# EAGLE design Olimex ESP32 POE Wing (EAGLE 9.6.0)
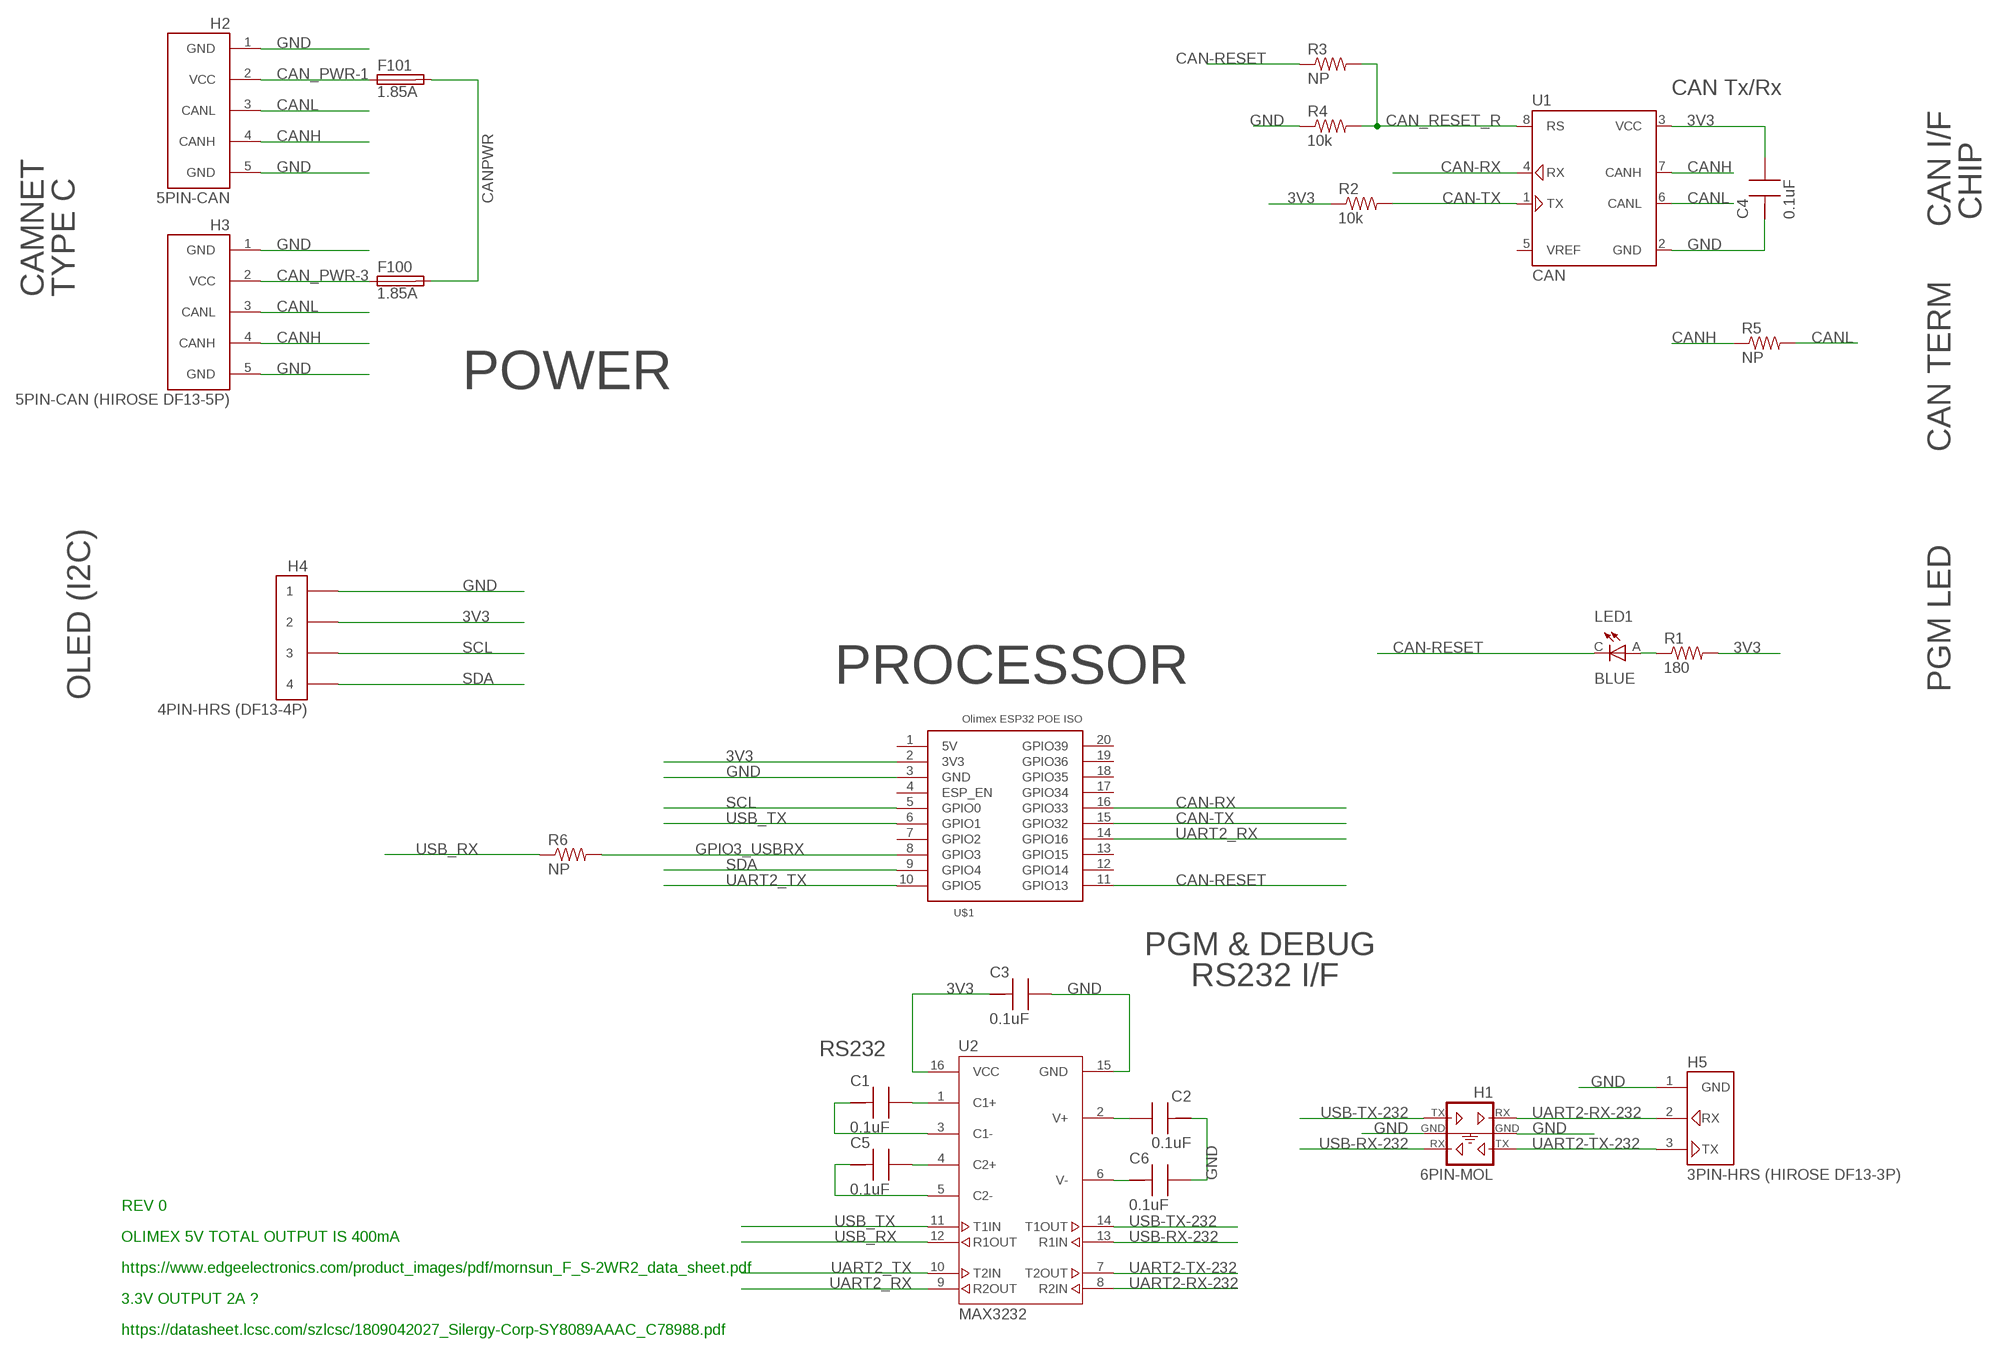
[diagram p0: schematic, sheet 1]

## Parts
C1  0.1uF  C-USC0805  [C0805]
C2  0.1uF  C-USC0805  [C0805]
C3  0.1uF  C-USC0805  [C0805]
C4  0.1uF  C-USC0805  [C0805]
C5  0.1uF  C-USC0805  [C0805]
C6  0.1uF  C-USC0805  [C0805]
F100  1.85A  BEL-OZCD  [2920]
F101  1.85A  BEL-OZCD  [2920]
H1  6PIN-MOL  6PIN-PGM-2MMVTH  [87831-0620]
H2  5PIN-CAN  5PIN-CAN-1.25MMVTH  [DF13-5P-1.25DSA]
H3  5PIN-CAN (HIROSE DF13-5P)  5PIN-CAN-1.25MMVTH  [DF13-5P-1.25DSA]
H4  4PIN-HRS (DF13-4P)  DF13-4P-1.25VTH  [DF13-4P-1.25DSA]
H5  3PIN-HRS (HIROSE DF13-3P)  3PIN-PGM-1.25MMVTH  [DF13-3P-1.25DSA]
LED1  BLUE  LED805SMT  [CHIPLED_0805]
R1  180  R-US_R0805  [R0805]
R2  10k  R-US_R0805  [R0805]
R3  NP  R-US_R0805  [R0805]
R4  10k  R-US_R0805  [R0805]
R5  NP  R-US_R0805  [R0805]
R6  NP  R-US_R0805  [R0805]
U1  CAN  SN65HVD230DR  [SO-08]
U2  MAX3232  MAX3232TSSOP16  [TSSOP16]
U$1  OLIMEX_POE_ISOPOEISO  [OLIMEX_POE_ISO]

## Nets
3V3 [Power]: C3.2(-) C4.1(+) H4.2 R1.2 R2.1 U1.3(VCC) U2.16(VCC) U$1.2(3V3)
BLUEX: LED1.A R1.1
C1+: C1.1(+) U2.1(C1+)
C1-: C1.2(-) U2.3(C1-)
C2+: C5.1(+) U2.4(C2+)
C2-: C5.2(-) U2.5(C2-)
CAN-RESET: LED1.C R3.1 U$1.11(GPIO13)
CAN-RX: U1.4(RX) U$1.16(GPIO33)
CAN-TX: R2.2 U1.1(TX) U$1.15(GPIO32)
CAN_PWR-1 [bigpower]: F101.P1 H2.2(VCC)
CAN_PWR-3 [bigpower]: F100.P1 H3.2(VCC)
CAN_RESET_R [DSP]: R3.2 R4.2 U1.8(RS)
CANH: H2.4(CANH) H3.4(CANH) R5.1 U1.7(CANH)
CANL: H2.3(CANL) H3.3(CANL) R5.2 U1.6(CANL)
CANPWR: F100.P2 F101.P2
GND [Power]: C2.2(-) C3.1(+) C4.2(-) C6.1(+) H1.3 H1.4 H2.1(GND) H2.5(GND) H3.1(GND) H3.5(GND) H4.1 H5.1(GND) R4.1 U1.2(GND) U2.15(GND) U$1.3(GND)
GPIO3_USBRX: R6.2 U$1.8(GPIO3)
SCL: H4.3 U$1.5(GPIO0)
SDA: H4.4 U$1.9(GPIO4)
UART2-RX-232: H1.1 H5.2(RX) U2.8(R2IN)
UART2-TX-232: H1.5 H5.3(TX) U2.7(T2OUT)
UART2_RX: U2.9(R2OUT) U$1.14(GPIO16)
UART2_TX: U2.10(T2IN) U$1.10(GPIO5)
USB-RX-232: H1.6 U2.13(R1IN)
USB-TX-232: H1.2 U2.14(T1OUT)
USB_RX: R6.1 U2.12(R1OUT)
USB_TX: U2.11(T1IN) U$1.6(GPIO1)
V+: C2.1(+) U2.2(V+)
V-: C6.2(-) U2.6(V-)
Unconnected: U1.5(VREF) U$1.4(ESP_EN) U$1.7(GPIO2) U$1.12(GPIO14) U$1.13(GPIO15) U$1.17(GPIO34) U$1.18(GPIO35) U$1.19(GPIO36) U$1.20(GPIO39)

## Notes on the sheet
- CAN Tx/Rx
- CAN I/F
- CHIP
- CAMNET | TYPE C
- POWER
- CAN TERM
- PGM LED
- PROCESSOR
- OLED (I2C)
- PGM & DEBUG
- RS232 I/F
- RS232
- REV 0
- OLIMEX 5V TOTAL OUTPUT IS 400mA
- https://www.edgeelectronics.com/product_images/pdf/mornsun_F_S-2WR2_data_sheet.pdf
- 3.3V OUTPUT 2A ?
- https://datasheet.lcsc.com/szlcsc/1809042027_Silergy-Corp-SY8089AAAC_C78988.pdf

## Power pins joined to a net without a drawn wire
5V: U$1.1(5V)

## Library data of the parts
C1-C6 = rcl:C-US: CAPACITOR, American symbol
F100 F101 = fuse:BEL-OZCD: 507-1370-1-ND
H1 = con-standard:6PIN-PGM-: 6 Pin Programming Header Molex Mfg PN: 87831-0620 Digikey PN: WM18558-ND
H2 H3 = con-standard:5PIN-CAN-: 5 Pin CAMNET Header 1.25mm Vertical Through Hole Mfg PN: DF13-5P-1.25DSA Digikey PN: H2194-ND 1.25mm Right Angle Through Hole Mfg PN: DF13-5P-1.25DS Digikey PN: H2202-ND 2mm Vertical Through Hole Mfg PN: DF3-5P-2DSA Digikey PN: H3924-ND
H4 = con-hirose:DF13-4P-1.25
H5 = con-standard:3PIN-PGM-: 3 Pin Programming Header Hirose Mfg PN: DF13-3P-1.25DSA Digikey PN: H2192-ND Right Angle Mfg PN: Digikey PN: Molex Mfg PN: 70553-0037 Digikey PN: WM4925-ND
LED1 = led:LED: LED OSRAM: - CHIPLED LG R971, LG N971, LY N971, LG Q971, LY Q971, LO R971, LY R971 LH N974, LH R974 LS Q976, LO Q976, LY Q976 LO Q996 - Hyper CHIPLED LW Q18S LB Q993, LB Q99A, LB R99A - SideLED LS A670, LO A670, LY A670, LG A670, LP A670 LB A673, LV A673, LT A673, LW A673 LH A674 LY A675 LS A676, LA A676, LO A676, LY A676, LW A676 LS A679, LY A679, LG A679 - Hyper Micro SIDELED® LS Y876, LA Y876, LO Y876, LY Y876 LT Y87S - SmartLED LW L88C, LW L88S LB L89C, LB L89S, LG L890 LS L89K, LO L89K, LY L89K LS L896, LA L896, LO L896, LY L896 - TOPLED LS T670, LO T670, LY T670, LG T670, LP T670 LSG T670, LSP T670, LSY T670, LOP T670, LYG T670 LG T671, LOG T671, LSG T671 LB T673, LV T673, LT T673, LW T673 LH T674 LS T676, LA T676, LO T676, LY T676, LB T676, LH T676, LSB T676, LW T676 LB T67C, LV T67C, LT T67C, LS T67K, LO T67K, LY T67K, LW E67C LS E67B, LA E67B, LO E67B, LY E67B, LB E67C, LV E67C, LT E67C LW T67C LS T679, LY T679, LG T679 LS T770, LO T770, LY T770, LG T770, LP T770 LB T773, LV T773, LT T773, LW T773 LH T774 LS E675, LA E675, LY E675, LS T675 LS T776, LA T776, LO T776, LY T776, LB T776 LHGB T686 LT T68C, LB T68C - Hyper Mini TOPLED® LB M676 - Mini TOPLED Santana® LG M470 LS M47K, LO M47K, LY M47K Source: http://www.osram.convergy.de/
R1-R6 = rcl:R-US_: RESISTOR, American symbol
U1 = texas:SN65HVD230DR: CAN Translator, Digikey - 296-13123-5-ND
U2 = maxim:MAX3232: RS-232 Transceiver SOIC-16 Maxim Mfg PN: MAX3232CSE+ Digikey PN: MAX3232CSE+-ND Texas Instruments Mfg PN: MAX3232CDR Digikey PN: 296-13094-1-ND
U$1 = ESP32-DEVKITC:OLIMEX_POE_ISO

## Net classes
0 default: width 0.203 mm, drill 0.203 mm, clearance 0.152 mm
1 Power: width 0.203 mm, drill 0.203 mm, clearance 0.152 mm
2 bigpower: clearance 0.152 mm
3 DSP: width 0.203 mm, clearance 0.152 mm

## Board
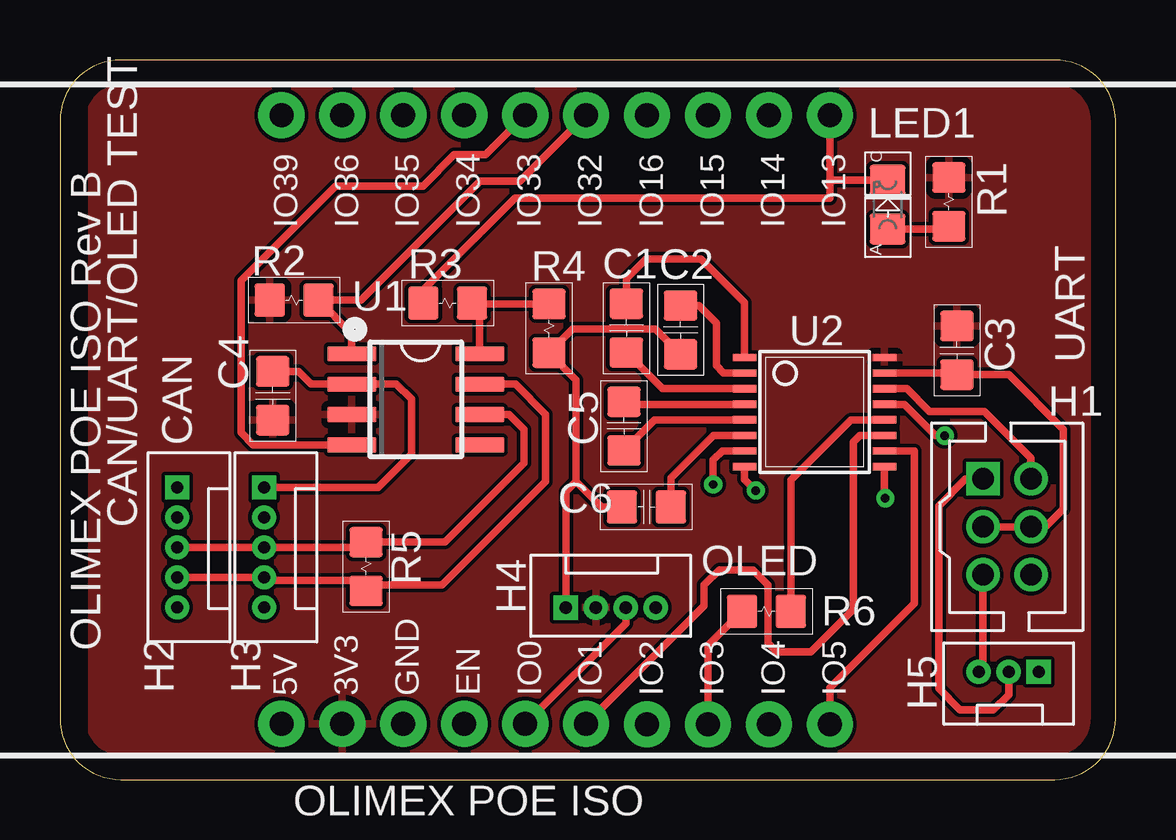
[diagram p1: board, top side]
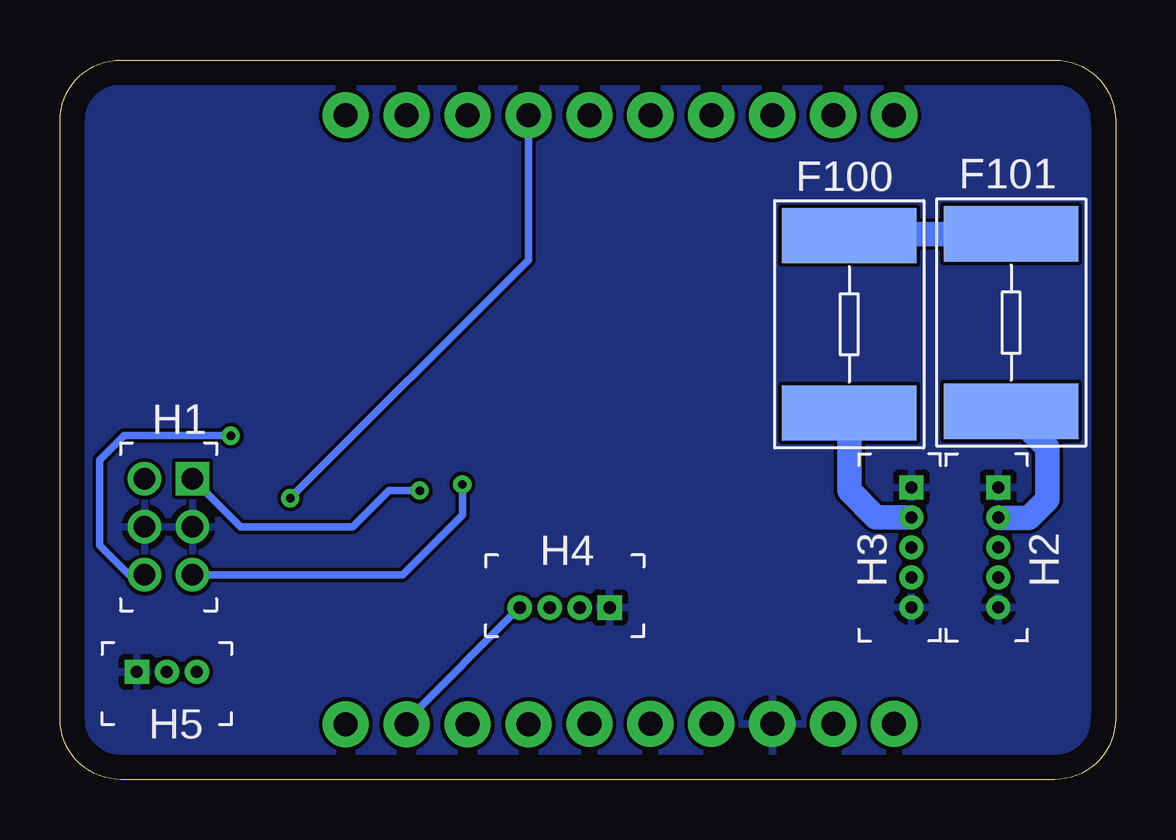
[diagram p2: board, bottom side, seen from below]

Size 44 x 30 mm. Coordinates in mm from the lower left corner, seen from the top.
Outline: 41.46,30 2.54,30 arc90 0,27.46 0,2.54 arc90 2.54,0 41.46,0 arc90 44,2.54 44,27.46 arc90 41.46,30
Copper layers (1*16): Top 0.035mm / dielectric 1.5mm / Bottom 0.035mm
Design rules "default": minimum track width 6mil, minimum drill 0.35mm, track to track 6mil, track to pad 6mil, pad to pad 6mil, via to via 6mil, smd to smd 6mil, copper to edge 40mil, drill to drill 6mil, minimum pad ring 10mil, minimum via ring 8mil, stop-mask expansion 4mil, vias tented up to drill 0mil, thermal gap 10mil

### Footprints (pad centres in the part's own frame; a part is rotated, then mirrored left to right if it is on the bottom)
C0805 = smd 1.27 x 1.397: 1 -1.016,0; 2 1.016,0
2920 = smd 2.301 x 5.601: P1 -3.7,0; P2 3.7,0
87831-0620 = drill 0.889 square: 1 -2,-1 | drill 0.889: 2 -2,1; 3 0,-1; 4 0,1; 5 2,-1; 6 2,1
DF13-5P-1.25DSA = drill 0.5 pad 0.737 square: 1 2.5,0 | drill 0.5 pad 0.737: 2 1.25,0; 3 0,0; 4 -1.25,0; 5 -2.5,0
DF13-4P-1.25DSA = drill 0.508 pad 0.737 square: 1 1.875,0 | drill 0.508 pad 0.737: 2 0.625,0; 3 -0.625,0; 4 -1.875,0
DF13-3P-1.25DSA = drill 0.5 pad 0.737 square: 1 1.25,0 | drill 0.5 pad 0.737: 2 0,0; 3 -1.25,0
CHIPLED_0805 = smd 1.5 x 1.3: A 0,-1.016; C 0,1.016
R0805 = smd 1.27 x 1.397: 1 -1.016,0; 2 1.016,0
SO-08 = smd 0.635 x 2.032: 1 -1.905,-2.667; 2 -0.635,-2.667; 3 0.635,-2.667; 4 1.905,-2.667; 5 1.905,2.667; 6 0.635,2.667; 7 -0.635,2.667; 8 -1.905,2.667
TSSOP16 = smd 0.305 x 0.991: 1 -2.275,-2.918; 2 -1.625,-2.918; 3 -0.975,-2.918; 4 -0.325,-2.918; 5 0.325,-2.918; 6 0.975,-2.918; 7 1.625,-2.918; 8 2.275,-2.918; 9 2.275,2.918; 10 1.625,2.918; 11 0.975,2.918; 12 0.325,2.918; 13 -0.325,2.918; 14 -0.975,2.918; 15 -1.625,2.918; 16 -2.275,2.918
OLIMEX_POE_ISO = drill 1 pad 1.93: 1 -18.27,-12.68; 2 -15.729,-12.68; 3 -13.19,-12.68; 4 -10.649,-12.68; 5 -8.11,-12.68; 6 -5.569,-12.68; 7 -3.03,-12.7; 8 -0.489,-12.7; 9 2.05,-12.7; 10 4.59,-12.7; 11 4.59,12.7; 12 2.05,12.7; 13 -0.489,12.7; 14 -3.03,12.7; 15 -5.569,12.7; 16 -8.11,12.7; 17 -10.649,12.7; 18 -13.19,12.7; 19 -15.729,12.7; 20 -18.27,12.7

### Placement (x,y rotation side)
C1  23.61,18.82 270 top
C2  25.87,18.74 270 top
C3  37.39,17.89 90 top
C4  8.87,16 90 top
C5  23.51,14.74 270 top
C6  24.45,11.37 0 top
F100  11.1,18.98 90 bottom
F101  4.35,19.05 90 bottom
H1  39.48,10.54 270 top
H2  4.89,9.68 90 top
H3  8.51,9.68 90 top
H4  22.96,7.17 180 top
H5  39.55,4.49 0 top
LED1  34.5,23.96 0 top
R1  37.05,24.09 90 top
R2  9.76,19.99 0 top
R3  16.16,19.86 0 top
R4  20.38,18.81 90 top
R5  12.76,8.88 90 top
R6  29.45,7.01 180 top
U1  14.83,15.85 270 top
U2  31.45,15.32 270 top
U$1  27.5,15 0 top

### Tracks (layer width: path | path; a pad name or v marks a point on that pad's centre or on a via)
3V3
  pour Top: 1.32,31.48 1.32,-0.27 43.23,-0.27 43.23,31.48
BLUEX
  Top 0.305: LED1.A 36.93,22.95 R1.1
C1+
  Top 0.305: U2.1 28.54,19.88 26.72,21.7 24.43,21.7 23.61,20.88 C1.1
C1-
  Top 0.305: U2.3 25.12,16.3 C1.2
C2+
  Top 0.305: U2.4 23.62,15.64 C5.1
C2-
  Top 0.305: C5.2 24.78,14.99 U2.5
CAN-RESET
  Top 0.305: U$1.11 32.09,24.86 | 32.09,24.86 32.09,24.24 18.97,24.24 15.14,20.41 R3.1 | LED1.C 32.22,24.98 32.09,24.86
CAN-RX
  Top 0.305: U$1.16 17.73,26.04 16.44,26.04 15.14,24.75 11.48,24.75 7.54,20.81 7.54,14.46 8.06,13.95 U1.4
CAN-TX
  Top 0.305: U$1.15 19.18,24.95 17.51,24.95 12.55,19.99 R2.2 12.16,18.6 U1.1
CAN_PWR-1
  Bottom 1.016: F101.P1 2.84,13.84 2.84,11.67 3.61,10.91 4.86,10.91 H2.2
CAN_PWR-3
  Bottom 1.016: H3.2 9.98,10.93 11.1,12.05 F100.P1
CAN_RESET_R
  Top 0.305: U1.8 17.5,19.54 R3.2 17.22,19.83 R4.2
CANH
  Top 0.305: U1.7 18.98,16.48 20.24,15.22 20.24,12.43 15.92,8.11 13.01,8.11 R5.1 12.32,8.3 8.64,8.3 H3.4 H2.4
CANL
  Top 0.305: U1.6 18.73,15.21 19.35,14.59 19.35,13.19 16.06,9.9 R5.2 12.54,9.68 H3.3 H2.3
CANPWR
  Bottom 1.016: F101.P2 11.03,22.75 F100.P2
GND
  Top 0.305: C2.2 24.82,18.78 21.37,18.78 R4.1 21.51,16.67 21.51,12.43 | 21.51,12.43 22.58,11.37 C6.1 | H4.1 21.09,12 21.51,12.43 | U2.15 37.32,16.95 C3.1 39.54,16.88 41.83,14.59 41.83,11.29 41.08,10.54 H1.4 H1.3 | C4.2 9.94,17.02 10.47,16.48 U1.2 12.17,16.49 14.02,16.49 14.66,15.86 14.66,13.57 13.26,12.18 H3.1
  pour Bottom: -2.49,31.48 -2.49,-1.54 48.31,-1.54 48.31,31.48
GPIO3_USBRX
  Top 0.305: U$1.8 27.01,5.59 R6.2
SCL
  Top 0.305: U$1.5 23.59,6.51 H4.3
SDA
  Bottom 0.305: H4.4 29.55,2.45 U$1.9
UART2-RX-232  (via drill 0.35)
  Top 0.305: U2.8 28.54,12.52 v29.01,12.05 | H5.2 39.55,3.54 38.91,2.91 37.52,2.91 36.63,3.79 36.63,11.41 37.75,12.54 H1.1
  Bottom 0.305: H1.1 36.47,10.53 31.8,10.53 30.28,12.05 v29.01,12.05
UART2-TX-232  (via drill 0.35)
  Top 0.305: v27.23,12.3 27.23,13.32 27.61,13.7 U2.7 | H5.3 38.48,4.67 H1.5
  Bottom 0.305: H1.5 29.73,8.54 27.23,11.03 v27.23,12.3
UART2_RX  (via drill 0.35)
  Top 0.305: U2.9 34.37,11.83 34.34,11.79 v34.4,11.73
  Bottom 0.305: v34.4,11.73 24.47,21.66 U$1.14
UART2_TX
  Top 0.305: U$1.10 32.09,3.83 35.61,7.35 35.61,13.7 U2.10
USB-RX-232  (via drill 0.35)
  Top 0.305: v36.88,14.34 36.5,14.34 35.19,15.64 U2.13
  Bottom 0.305: H1.6 41.11,8.54 42.34,9.76 42.34,13.32 41.33,14.34 v36.88,14.34
USB-TX-232
  Top 0.305: U2.14 35.3,16.3 36.24,15.35 38.53,15.35 40.48,13.41 H1.2
USB_RX
  Top 0.305: R6.1 30.47,12.49 32.97,14.99 U2.12
USB_TX
  Top 0.305: U$1.6 26.85,7.24 26.85,8.11 27.48,8.75 28.88,8.75 29.51,8.11 29.51,5.7 29.9,5.32 31.29,5.32 33.07,7.1 33.07,14.08 33.33,14.35 U2.11
V+
  Top 0.305: U2.2 27.67,16.95 27.35,17.26 27.35,19.03 26.63,19.76 C2.1
V-
  Top 0.305: C6.2 25.46,12.57 27.24,14.35 U2.6

### Text on the board
tNames: UART | CAN | CAN/UART/OLED TEST | OLED | OLIMEX POE ISO Rev B